# Altium schematic sheet LPCB218 - PARK BRAKE.SchDoc
size A3; Address1: Factory 10; Address2: 9-13 Dingley Avenue, Dandeong, VICTORIA 3175, AUSTRALIA; DocumentNumber: 14; Revision: 1; SheetNumber: 14; SheetTotal: 14; Lockie__PCB_SUB_ASSEMBLY: Park Brake; Lockie__PCB_ASSEMBLY: Command Node; Lockie__LDL: LPCB218; Lockie__PCB_DESCRIPTION: Command Node
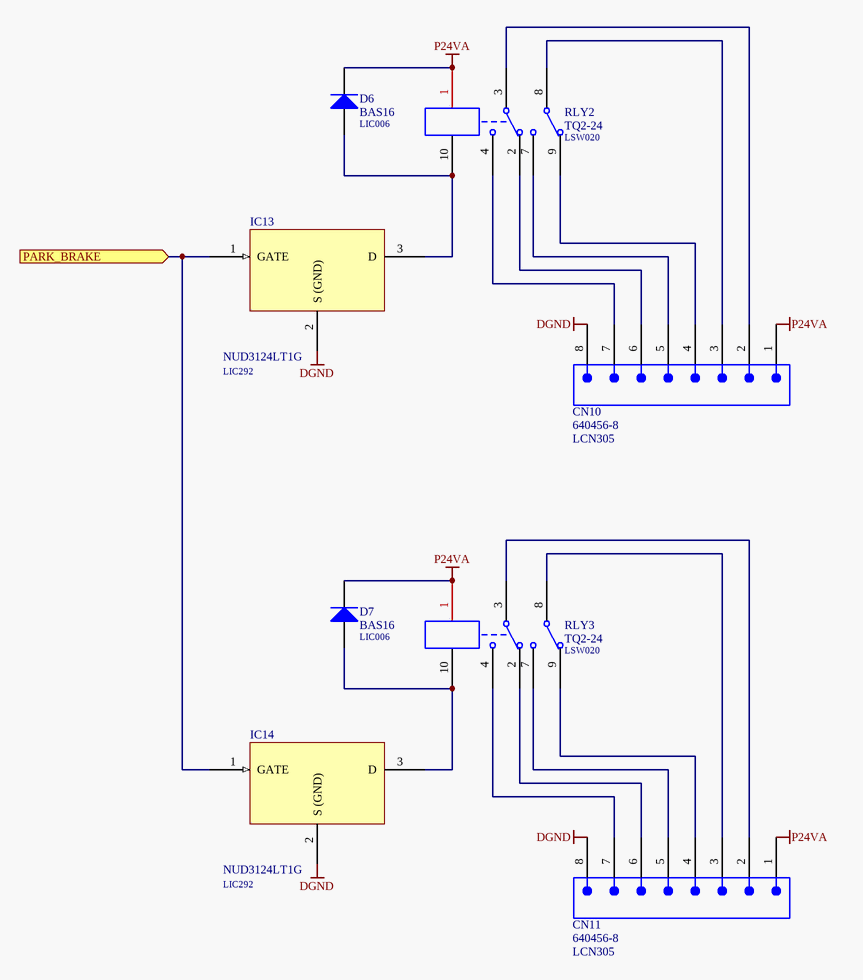
[diagram p0: LPCB218 - PARK BRAKE.SchDoc]

## Parts
CN10  640456-8  LDL_NUMBER: LCN305  [640456-8]
CN11  640456-8  LDL_NUMBER: LCN305  [640456-8]
D6  BAS16  LDL_NUMBER: LIC006  [LFP021__SOT23]
D7  BAS16  LDL_NUMBER: LIC006  [LFP021__SOT23]
IC13  NUD3124LT1G  LDL_NUMBER: LIC292  [LFP021__SOT23]
IC14  NUD3124LT1G  LDL_NUMBER: LIC292  [LFP021__SOT23]
RLY2  TQ2-24  LDL_NUMBER: LSW020  [TQ2]
RLY3  TQ2-24  LDL_NUMBER: LSW020  [TQ2]

## Ports
PARK_BRAKE (in)

## Nets
DGND: CN10.8 CN11.8 IC13.2(S_(GND)) IC14.2(S_(GND))
P24VA: CN10.1 CN11.1 D6.3(K) D7.3(K) RLY2.1 RLY3.1
PARK_BRAKE: IC13.1(GATE) IC14.1(GATE) ; port PARK_BRAKE
NetCN10_2: CN10.2 RLY2.3
NetCN10_3: CN10.3 RLY2.8
NetCN10_4: CN10.4 RLY2.9
NetCN10_5: CN10.5 RLY2.7
NetCN10_6: CN10.6 RLY2.2
NetCN10_7: CN10.7 RLY2.4
NetCN11_2: CN11.2 RLY3.3
NetCN11_3: CN11.3 RLY3.8
NetCN11_4: CN11.4 RLY3.9
NetCN11_5: CN11.5 RLY3.7
NetCN11_6: CN11.6 RLY3.2
NetCN11_7: CN11.7 RLY3.4
NetD6_1: D6.1(A) IC13.3(D) RLY2.10
NetD7_1: D7.1(A) IC14.3(D) RLY3.10

## Notes on the sheet
- PCB COMPONENT DESCRIPTION
- LDL NUMBER
- Assembly Details
- Size
- Drawing File Name
- Revision
- http://rloop.org
- Scale
- A3
- Sheet Details
- N.T.S
- Sheet:
- Of:

## Library data of the parts
CN10 CN11 = 640456-8: Connector, Male Header, 8 Way; FMEDA__CHANNEL: COM; FMEDA__OPERATING__CURRENT_MAX: 0; FMEDA__OPERATING__TEMP_MAX: 50; FMEDA__OPERATING__TEMP_MIN: -20; FMEDA__OPERATING__TEMP_TYP: 27; FMEDA__OPERATING__VOLTAGE_MAX: 16; FMEDA__OPERATING__VOLTAGE_TYP: 12; FMEDA__FUNCTION_IN_SYSTEM: *; FMEDA__OPERATING__CURRENT_MIN: 0; FMEDA__OPERATING__CURRENT_TYP: 0; FMEDA__OPERATING__VOLTAGE_MIN: 0
D6 D7 = BAS16: Diode, Small Signal, 0.2A, 85V, SMD SOT-23 [LIC006]; FMEDA__OPERATING__CURRENT_MIN: 0; FMEDA__OPERATING__TEMP_MIN: -20; FMEDA__OPERATING__TEMP_TYP: 27; FMEDA__OPERATING__TEMP_MAX: 50; FMEDA__CHANNEL: COM; FMEDA__OPERATING__CURRENT_MAX: 0; FMEDA__OPERATING__VOLTAGE_MIN: 0; FMEDA__OPERATING__VOLTAGE_MAX: 0; FMEDA__FUNCTION_IN_SYSTEM: *; FMEDA__OPERATING__CURRENT_TYP: 0; FMEDA__OPERATING__VOLTAGE_TYP: 0
IC13 IC14 = NUD3124LT1G: IC, Relay Driver, 28V Industrial, SMD SOT23 [LIC292]; FMEDA__OPERATING__TEMP_MIN: -20; FMEDA__OPERATING__TEMP_TYP: 27; FMEDA__OPERATING__TEMP_MAX: 50; FMEDA__OPERATING__VOLTAGE_MIN: 0; FMEDA__OPERATING__VOLTAGE_TYP: 13; FMEDA__OPERATING__VOLTAGE_MAX: 18; FMEDA__OPERATING__POWER_TYP: 0.1; FMEDA__OPERATING__POWER_MAX: 0.15; FMEDA__CHANNEL: COM; FMEDA__FUNCTION_IN_SYSTEM: *; FMEDA__OPERATING__POWER_MIN: 0
RLY2 RLY3 = TQ2-24: Relay, DPDT, Non Latching, 24VDC Coil, 1A Rating, PTH; FMEDA__CHANNEL: COM; FMEDA__OPERATING__TEMP_MAX: 50; FMEDA__OPERATING__TEMP_MIN: -20; FMEDA__OPERATING__TEMP_TYP: 27; Revision: July-2002: Re-released for DXP Platform.